# EAGLE design shield (EAGLE 8.5.1)
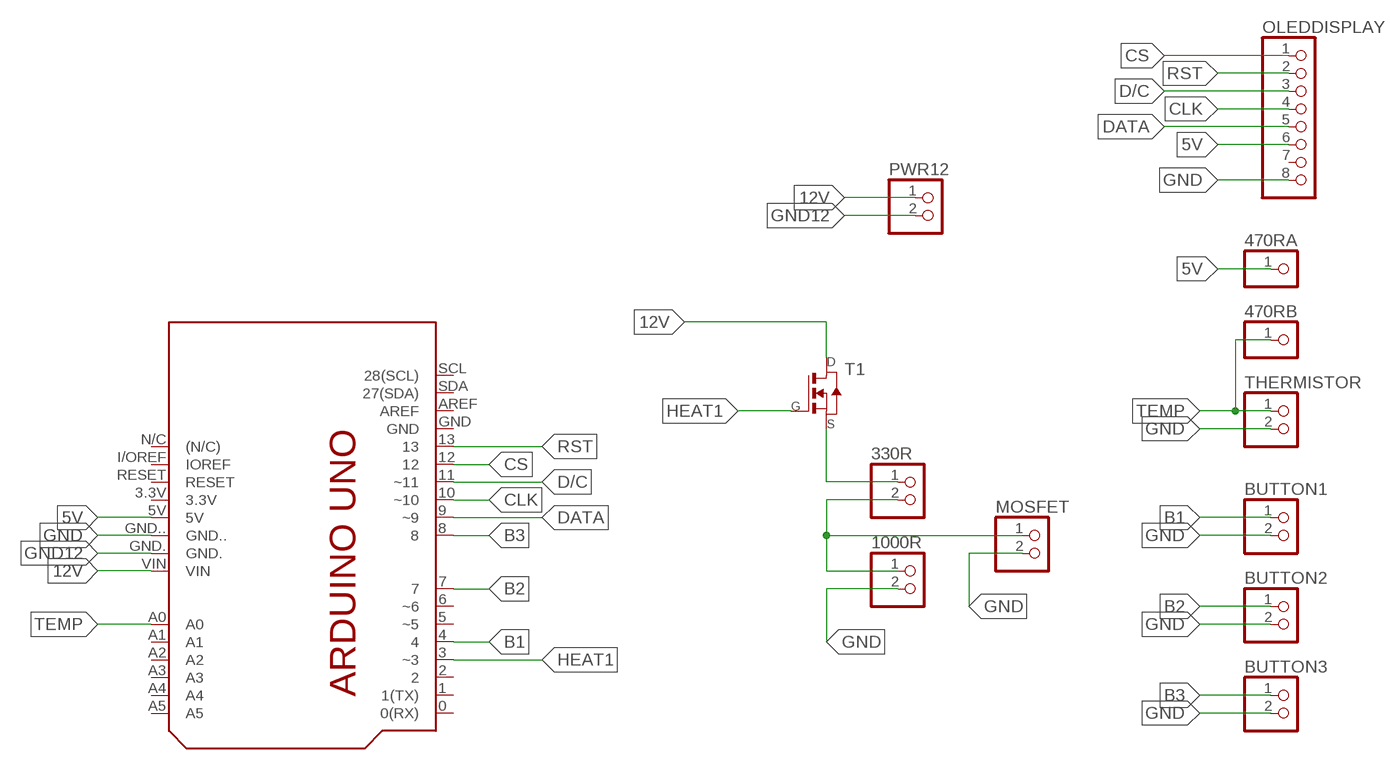
[diagram p0: schematic, sheet 1]

## Parts
330R  PINHD-1X2  [1X02]
470RA  PINHD-1X1  [1X01]
470RB  PINHD-1X1  [1X01]
1000R  PINHD-1X2  [1X02]
BUTTON1  PINHD-1X2  [1X02]
BUTTON2  PINHD-1X2  [1X02]
BUTTON3  PINHD-1X2  [1X02]
MOSFET  PINHD-1X2  [1X02]
OLEDDISPLAY  PINHD-1X8  [1X08]
PCB1  ARDUINO_UNO_UNBOUND  [ARDUINO_UNO_UNBOUND]
PWR12  PINHD-1X2  [1X02]
T1  NMOSFETTO252  [TO252]
THERMISTOR  PINHD-1X2  [1X02]

## Nets
5V: 470RA.1 OLEDDISPLAY.6 PCB1.5V
12V: PCB1.VIN PWR12.1 T1.3(D)
B1: BUTTON1.1 PCB1.4
B2: BUTTON2.1 PCB1.7
B3: BUTTON3.1 PCB1.8
CLK: OLEDDISPLAY.4 PCB1.10(~10)
CS: OLEDDISPLAY.1 PCB1.12
D/C: OLEDDISPLAY.3 PCB1.11(~11)
DATA: OLEDDISPLAY.5 PCB1.9(~9)
GND: 1000R.2 BUTTON1.2 BUTTON2.2 BUTTON3.2 MOSFET.2 OLEDDISPLAY.8 PCB1.GND.. THERMISTOR.2
GND12: PCB1.GND. PWR12.2
HEAT1: PCB1.3(~3) T1.1(G)
N$2: 330R.2 1000R.1 MOSFET.1
N$4: 330R.1 T1.2(S)
RST: OLEDDISPLAY.2 PCB1.13
TEMP: 470RB.1 PCB1.A0 THERMISTOR.1
Unconnected: OLEDDISPLAY.7 PCB1.0(0(RX)) PCB1.1(1(TX)) PCB1.2 PCB1.3.3V PCB1.5(~5) PCB1.6(~6) PCB1.A1 PCB1.A2 PCB1.A3 PCB1.A4 PCB1.A5 PCB1.AREF PCB1.GND PCB1.I/OREF(IOREF) PCB1.N/C((N/C)) PCB1.RESET PCB1.SCL(28(SCL)) PCB1.SDA(27(SDA))

## Library data of the parts
330R 1000R BUTTON1-BUTTON3 MOSFET PWR12 THERMISTOR = pinhead:PINHD-1X2: PIN HEADER
470RA 470RB = pinhead:PINHD-1X1: PIN HEADER
OLEDDISPLAY = pinhead:PINHD-1X8: PIN HEADER
PCB1 = E14_Arduino_revC:ARDUINO_UNO_UNBOUND
T1 = fab:NMOSFET: MOS FET

## Board
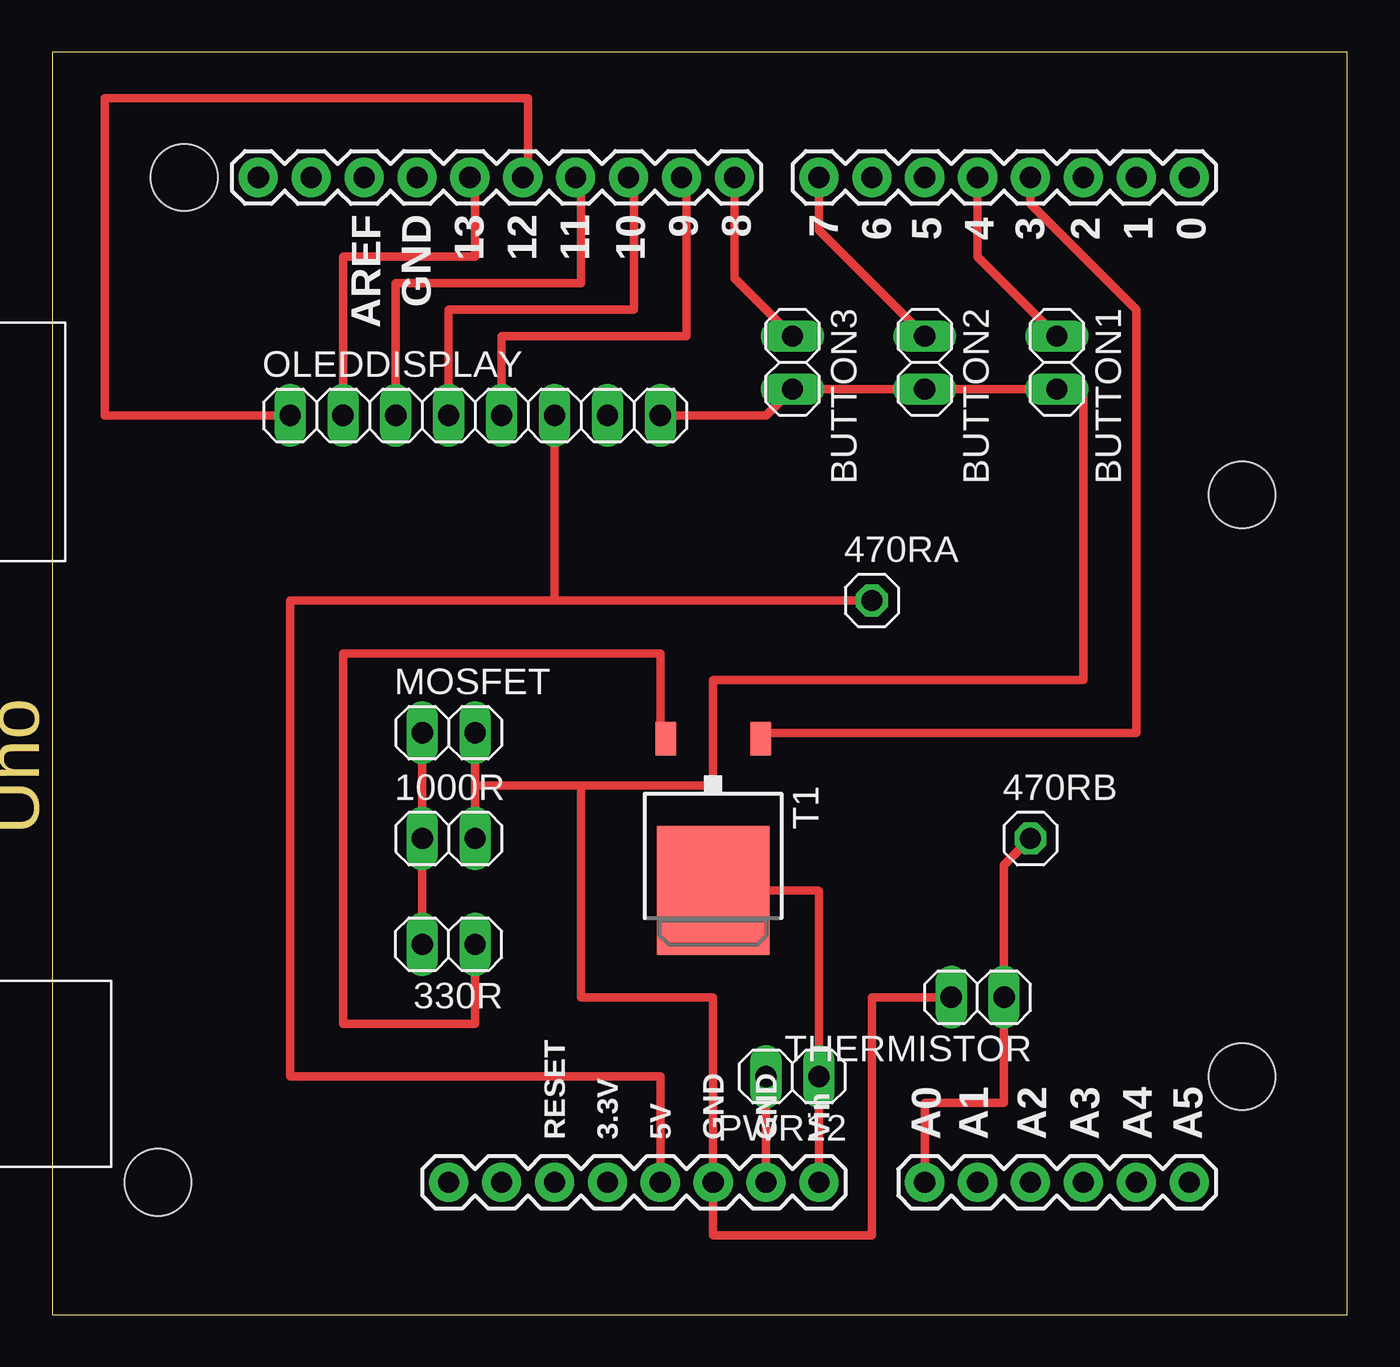
[diagram p1: board, top side]

Size 62.21 x 60.63 mm. Coordinates in mm from the lower left corner, seen from the top.
Outline: 0,0 62.21,0 62.21,60.63 0,60.63 0,0
Copper layers (1*16): Top 0.035mm / dielectric 1.5mm / Bottom 0.035mm
Design rules "default *": minimum track width 24mm, minimum drill 16mm, track to track 16mil, track to pad 16mil, pad to pad 16mil, via to via 16mil, smd to smd 6mil, copper to edge 40mil, drill to drill 6mil, minimum pad ring 10mil, minimum via ring 8mil, stop-mask expansion 4mil, vias tented up to drill 0mil, thermal gap 10mil

### Footprints (pad centres in the part's own frame; a part is rotated, then mirrored left to right if it is on the bottom)
1X02 = drill 1.016 long: 1 -1.27,0; 2 1.27,0
1X01 = drill 1.016 octagon: 1 0,0
1X08 = drill 1.016 long: 1 -8.89,0; 2 -6.35,0; 3 -3.81,0; 4 -1.27,0; 5 1.27,0; 6 3.81,0; 7 6.35,0; 8 8.89,0
ARDUINO_UNO_UNBOUND = drill 1.016 pad 1.88: 0 63.5,50.8; 1 60.96,50.8; 2 58.42,50.8; 3 55.88,50.8; 3.3V 35.56,2.54; 4 53.34,50.8; 5 50.8,50.8; 5V 38.1,2.54; 6 48.26,50.8; 7 45.72,50.8; 8 41.656,50.8; 9 39.116,50.8; 10 36.576,50.8; 11 34.036,50.8; 12 31.496,50.8; 13 28.956,50.8; A0 50.8,2.54; A1 53.34,2.54; A2 55.88,2.54; A3 58.42,2.54; A4 60.96,2.54; A5 63.5,2.54; AREF 23.876,50.8; GND 26.416,50.8; GND. 43.18,2.54; GND.. 40.64,2.54; I/OREF 30.48,2.54; N/C 27.94,2.54; RESET 33.02,2.54; SCL 18.796,50.8; SDA 21.336,50.8; VIN 45.72,2.54 | hole 3.2: 66.04,7.62; 66.04,35.56; 15.24,50.8; 13.97,2.54
TO252 = smd 1 x 1.6: 1 -2.28,-4.8; 2 2.28,-4.8 | smd 5.4 x 6.2: 3 0,2.5

### Placement (x,y rotation side)
330R  19.05,17.78 180 top
470RA  39.37,34.29 0 top
470RB  46.99,22.86 0 top
1000R  19.05,22.86 0 top
BUTTON1  48.26,45.72 270 top
BUTTON2  41.91,45.72 270 top
BUTTON3  35.56,45.72 270 top
MOSFET  19.05,27.94 0 top
OLEDDISPLAY  20.32,43.18 0 top
PCB1  -8.89,3.81 0 top
PWR12  35.56,11.43 180 top
T1  31.75,22.86 180 top
THERMISTOR  44.45,15.24 180 top

### Tracks (layer width: path | path; a pad name or v marks a point on that pad's centre or on a via)
5V
  Top 0.406: 24.13,34.29 11.43,34.29 11.43,11.43 29.21,11.43 PCB1.5V | OLEDDISPLAY.6 24.13,34.29 | 470RA.1 24.13,34.29
12V
  Top 0.406: PCB1.VIN PWR12.1 36.83,20.32 36.79,20.36 T1.3
B1
  Top 0.406: BUTTON1.1 44.45,50.8 PCB1.4
B2
  Top 0.406: BUTTON2.1 36.83,52.07 PCB1.7
B3
  Top 0.406: BUTTON3.1 32.77,49.78 PCB1.8
CLK
  Top 0.406: OLEDDISPLAY.4 19.05,48.26 27.94,48.26 27.94,54.36 PCB1.10
CS
  Top 0.406: OLEDDISPLAY.1 2.54,43.18 2.54,58.42 22.86,58.42 22.86,54.86 PCB1.12
D/C
  Top 0.406: OLEDDISPLAY.3 16.51,49.53 25.4,49.53 25.4,54.36 PCB1.11
DATA
  Top 0.406: OLEDDISPLAY.5 21.59,46.99 30.48,46.99 30.48,54.36 PCB1.9
GND
  Top 0.406: MOSFET.2 20.32,25.4 | 20.32,25.4 1000R.2 | 25.4,25.4 25.4,15.24 31.75,15.24 PCB1.GND.. 31.75,3.81 39.37,3.81 39.37,15.24 THERMISTOR.2 | 25.4,25.4 20.32,25.4 | OLEDDISPLAY.8 34.29,43.18 BUTTON3.2 BUTTON2.2 BUTTON1.2 49.53,44.45 49.53,30.48 31.75,30.48 31.75,25.4 25.4,25.4
GND12
  Top 0.406: PWR12.2 PCB1.GND.
HEAT1
  Top 0.406: T1.1 34.31,27.94 52.07,27.94 52.07,48.26 46.99,53.34 PCB1.3
N$2
  Top 0.406: MOSFET.1 1000R.1 330R.2
N$4
  Top 0.406: T1.2 29.19,27.94 29.21,27.94 29.21,31.75 13.97,31.75 13.97,13.97 20.32,13.97 330R.1
RST
  Top 0.406: OLEDDISPLAY.2 13.97,50.8 20.32,50.8 20.32,54.36 PCB1.13
TEMP
  Top 0.406: PCB1.A0 41.91,10.16 45.72,10.16 THERMISTOR.1 45.72,21.59 470RB.1